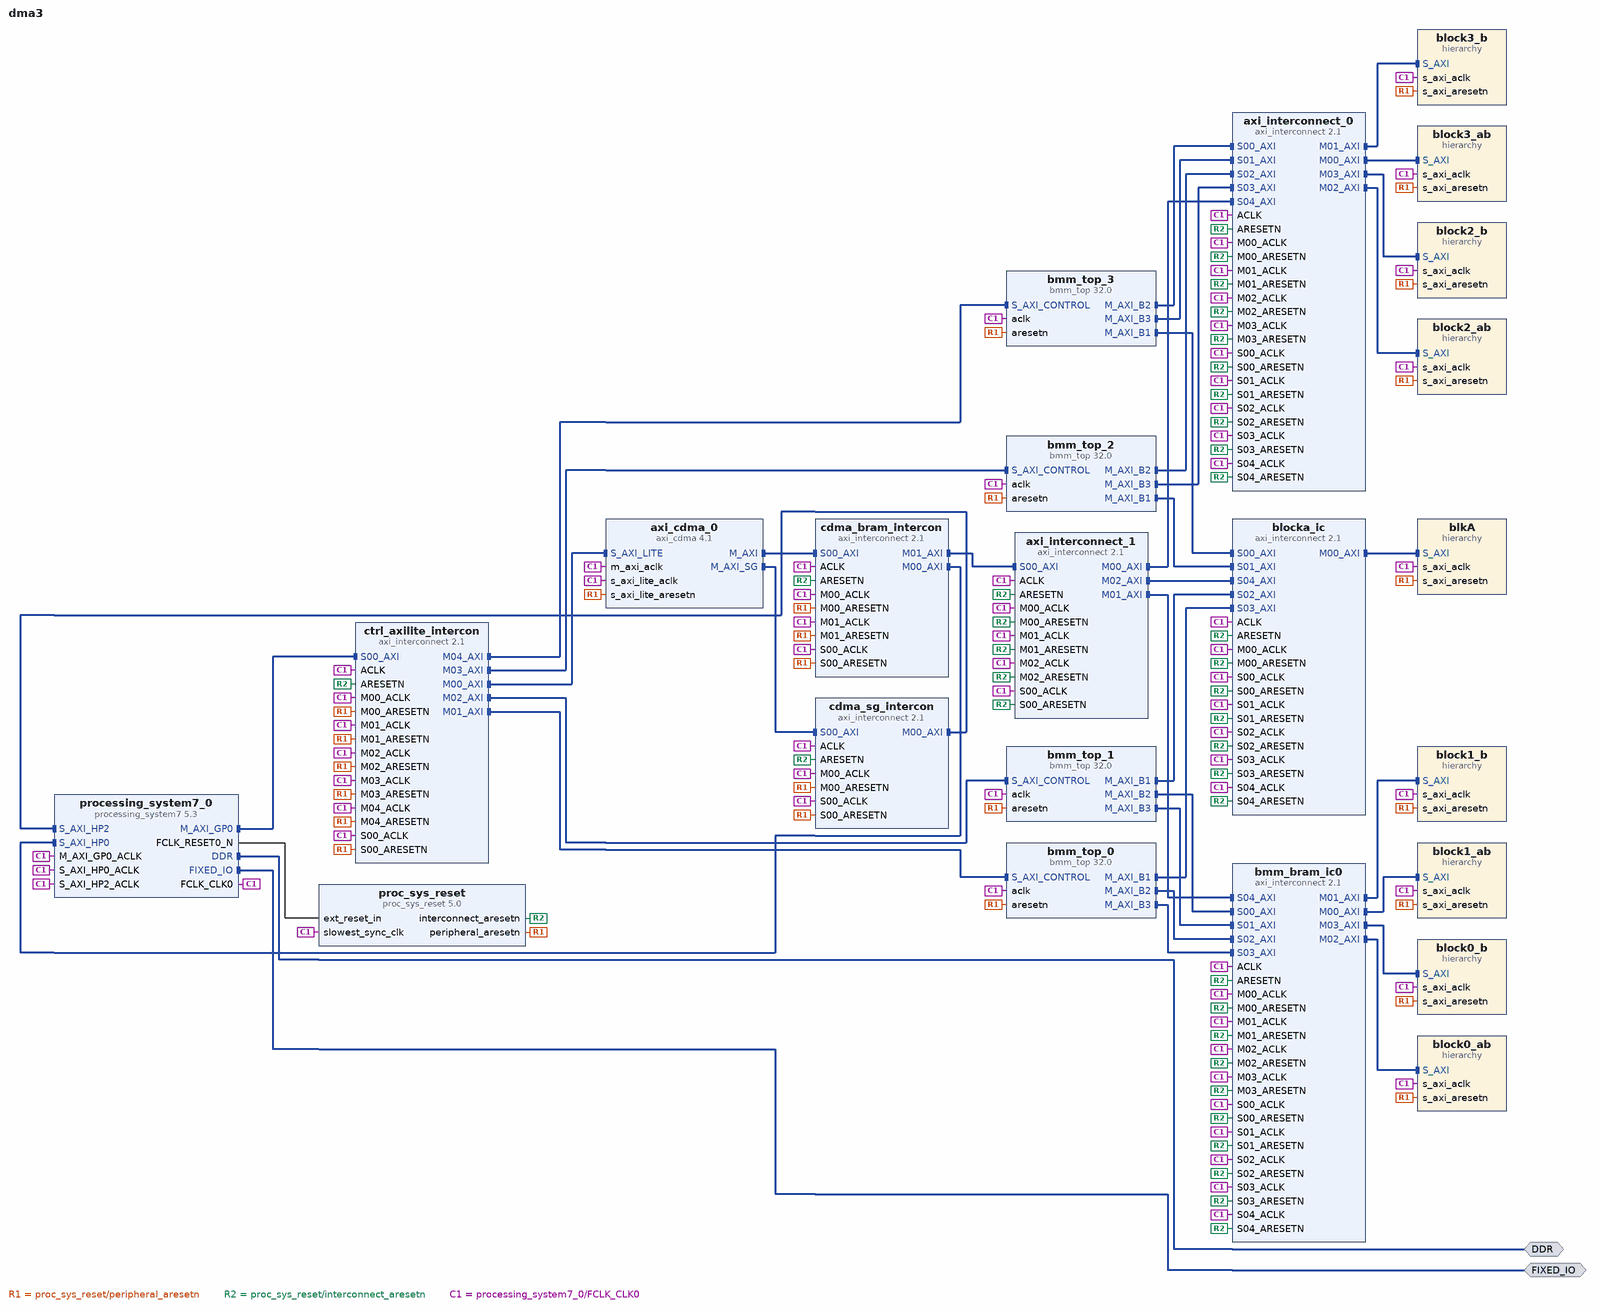
[diagram p0: block diagram of the top level]
# Vivado block design dma3, Vivado 2013.3
create_bd_design dma3

create_bd_intf_port -mode Master -vlnv xilinx.com:interface:ddrx_rtl:1.0 DDR
create_bd_intf_port -mode Master -vlnv xilinx.com:display_processing_system7:fixedio_rtl:1.0 FIXED_IO

create_bd_cell -type ip -vlnv xilinx.com:ip:processing_system7:5.3 processing_system7_0
set_property -dict [list \
  CONFIG.PCW_USE_S_AXI_HP0 1 \
  CONFIG.PCW_USE_S_AXI_HP2 1 \
  CONFIG.PCW_S_AXI_HP0_DATA_WIDTH 32 \
  CONFIG.PCW_S_AXI_HP2_DATA_WIDTH 32 \
  CONFIG.preset {ZC706*} \
] [get_bd_cells processing_system7_0]
create_bd_cell -type ip -vlnv xilinx.com:ip:axi_interconnect:2.1 ctrl_axilite_intercon
set_property -dict {CONFIG.NUM_MI 5} [get_bd_cells ctrl_axilite_intercon]
create_bd_cell -type ip -vlnv xilinx.com:ip:proc_sys_reset:5.0 proc_sys_reset
create_bd_cell -type ip -vlnv xilinx.com:ip:axi_interconnect:2.1 cdma_bram_intercon
set_property -dict {CONFIG.NUM_MI 2} [get_bd_cells cdma_bram_intercon]
create_bd_cell -type ip -vlnv xilinx.com:ip:axi_cdma:4.1 axi_cdma_0
set_property -dict {CONFIG.C_M_AXI_DATA_WIDTH 256 CONFIG.C_M_AXI_MAX_BURST_LEN 16 CONFIG.C_INCLUDE_SG 1} [get_bd_cells axi_cdma_0]
create_bd_cell -type ip -vlnv xilinx.com:ip:axi_interconnect:2.1 cdma_sg_intercon
set_property -dict {CONFIG.NUM_MI 1} [get_bd_cells cdma_sg_intercon]
create_bd_cell -type hier blkA
create_bd_cell -type hier block0_ab
create_bd_cell -type hier block0_b
create_bd_cell -type hier block1_ab
create_bd_cell -type hier block1_b
create_bd_cell -type hier block2_b
create_bd_cell -type hier block2_ab
create_bd_cell -type hier block3_b
create_bd_cell -type hier block3_ab
create_bd_cell -type ip -vlnv xilinx.com:ip:axi_interconnect:2.1 blocka_ic
set_property -dict {CONFIG.NUM_SI 5 CONFIG.NUM_MI 1} [get_bd_cells blocka_ic]
create_bd_cell -type ip -vlnv xilinx.com:ip:axi_interconnect:2.1 bmm_bram_ic0
set_property -dict {CONFIG.NUM_SI 5 CONFIG.NUM_MI 4} [get_bd_cells bmm_bram_ic0]
create_bd_cell -type ip -vlnv xilinx.com:ip:axi_interconnect:2.1 axi_interconnect_0
set_property -dict {CONFIG.NUM_SI 5 CONFIG.NUM_MI 4} [get_bd_cells axi_interconnect_0]
create_bd_cell -type ip -vlnv xilinx.com:ip:axi_interconnect:2.1 axi_interconnect_1
set_property -dict {CONFIG.NUM_SI 1 CONFIG.NUM_MI 3} [get_bd_cells axi_interconnect_1]
create_bd_cell -type ip -vlnv xilinx.com:hls:bmm_top:32.0 bmm_top_0
set_property -dict [list \
  CONFIG.C_M_AXI_B1_DATA_WIDTH 256 \
  CONFIG.C_M_AXI_B1_TARGET_ADDR 0xC0000000 \
  CONFIG.C_M_AXI_B2_DATA_WIDTH 256 \
  CONFIG.C_M_AXI_B2_TARGET_ADDR 0xC1000000 \
  CONFIG.C_M_AXI_B3_DATA_WIDTH 256 \
  CONFIG.C_M_AXI_B3_TARGET_ADDR 0xC2000000 \
] [get_bd_cells bmm_top_0]
create_bd_cell -type ip -vlnv xilinx.com:hls:bmm_top:32.0 bmm_top_1
set_property -dict [list \
  CONFIG.C_M_AXI_B1_DATA_WIDTH 256 \
  CONFIG.C_M_AXI_B1_TARGET_ADDR 0xC0000000 \
  CONFIG.C_M_AXI_B2_DATA_WIDTH 256 \
  CONFIG.C_M_AXI_B2_TARGET_ADDR 0xC3000000 \
  CONFIG.C_M_AXI_B3_DATA_WIDTH 256 \
  CONFIG.C_M_AXI_B3_TARGET_ADDR 0xC4000000 \
] [get_bd_cells bmm_top_1]
create_bd_cell -type ip -vlnv xilinx.com:hls:bmm_top:32.0 bmm_top_2
set_property -dict [list \
  CONFIG.C_M_AXI_B1_DATA_WIDTH 256 \
  CONFIG.C_M_AXI_B1_TARGET_ADDR 0xC0000000 \
  CONFIG.C_M_AXI_B2_DATA_WIDTH 256 \
  CONFIG.C_M_AXI_B2_TARGET_ADDR 0xC5000000 \
  CONFIG.C_M_AXI_B3_DATA_WIDTH 256 \
  CONFIG.C_M_AXI_B3_TARGET_ADDR 0xC6000000 \
] [get_bd_cells bmm_top_2]
create_bd_cell -type ip -vlnv xilinx.com:hls:bmm_top:32.0 bmm_top_3
set_property -dict [list \
  CONFIG.C_M_AXI_B1_DATA_WIDTH 256 \
  CONFIG.C_M_AXI_B1_TARGET_ADDR 0xC0000000 \
  CONFIG.C_M_AXI_B2_DATA_WIDTH 256 \
  CONFIG.C_M_AXI_B2_TARGET_ADDR 0xC7000000 \
  CONFIG.C_M_AXI_B3_DATA_WIDTH 256 \
  CONFIG.C_M_AXI_B3_TARGET_ADDR 0xC8000000 \
] [get_bd_cells bmm_top_3]

# ---- hierarchy /blkA ----
current_bd_instance /blkA
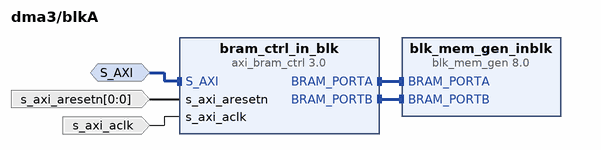
[diagram p1: block diagram inside /blkA]
create_bd_intf_pin -mode Slave -vlnv xilinx.com:interface:aximm_rtl:1.0 S_AXI
create_bd_pin -dir I -from 0 -to 0 -type rst s_axi_aresetn
create_bd_pin -dir I -type clk s_axi_aclk

create_bd_cell -type ip -vlnv xilinx.com:ip:axi_bram_ctrl:3.0 bram_ctrl_in_blk
set_property -dict {CONFIG.DATA_WIDTH 256 CONFIG.PROTOCOL AXI4 CONFIG.SINGLE_PORT_BRAM 0} [get_bd_cells bram_ctrl_in_blk]
create_bd_cell -type ip -vlnv xilinx.com:ip:blk_mem_gen:8.0 blk_mem_gen_inblk
set_property -dict [list \
  CONFIG.Memory_Type True_Dual_Port_RAM \
  CONFIG.Enable_32bit_Address true \
  CONFIG.Write_Width_A 32 \
  CONFIG.Write_Depth_A 8192 \
  CONFIG.Operating_Mode_A WRITE_FIRST \
  CONFIG.use_bram_block BRAM_Controller \
] [get_bd_cells blk_mem_gen_inblk]

# ---- hierarchy /block0_ab ----
current_bd_instance /block0_ab
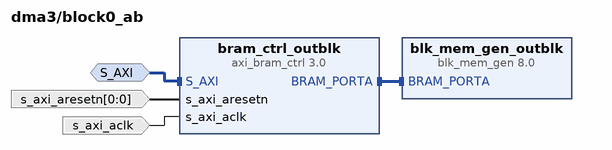
[diagram p2: block diagram inside /block0_ab]
create_bd_intf_pin -mode Slave -vlnv xilinx.com:interface:aximm_rtl:1.0 S_AXI
create_bd_pin -dir I -from 0 -to 0 -type rst s_axi_aresetn
create_bd_pin -dir I -type clk s_axi_aclk

create_bd_cell -type ip -vlnv xilinx.com:ip:axi_bram_ctrl:3.0 bram_ctrl_outblk
set_property -dict {CONFIG.DATA_WIDTH 256 CONFIG.PROTOCOL AXI4 CONFIG.SINGLE_PORT_BRAM 1} [get_bd_cells bram_ctrl_outblk]
create_bd_cell -type ip -vlnv xilinx.com:ip:blk_mem_gen:8.0 blk_mem_gen_outblk
set_property -dict [list \
  CONFIG.Enable_32bit_Address true \
  CONFIG.Write_Width_A 32 \
  CONFIG.Write_Depth_A 8192 \
  CONFIG.Read_Width_A 32 \
  CONFIG.use_bram_block BRAM_Controller \
] [get_bd_cells blk_mem_gen_outblk]

# ---- hierarchy /block0_b ----
current_bd_instance /block0_b
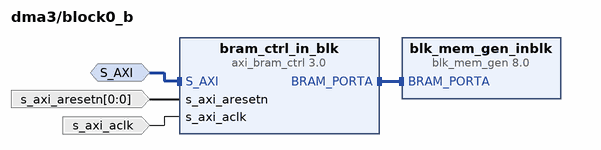
[diagram p3: block diagram inside /block0_b]
create_bd_intf_pin -mode Slave -vlnv xilinx.com:interface:aximm_rtl:1.0 S_AXI
create_bd_pin -dir I -from 0 -to 0 -type rst s_axi_aresetn
create_bd_pin -dir I -type clk s_axi_aclk

create_bd_cell -type ip -vlnv xilinx.com:ip:axi_bram_ctrl:3.0 bram_ctrl_in_blk
set_property -dict {CONFIG.DATA_WIDTH 256 CONFIG.PROTOCOL AXI4 CONFIG.SINGLE_PORT_BRAM 1} [get_bd_cells bram_ctrl_in_blk]
create_bd_cell -type ip -vlnv xilinx.com:ip:blk_mem_gen:8.0 blk_mem_gen_inblk
set_property -dict [list \
  CONFIG.Memory_Type Single_Port_RAM \
  CONFIG.Enable_32bit_Address true \
  CONFIG.Write_Width_A 32 \
  CONFIG.Write_Depth_A 8192 \
  CONFIG.Operating_Mode_A WRITE_FIRST \
  CONFIG.use_bram_block BRAM_Controller \
] [get_bd_cells blk_mem_gen_inblk]

# ---- hierarchy /block1_ab ----
current_bd_instance /block1_ab
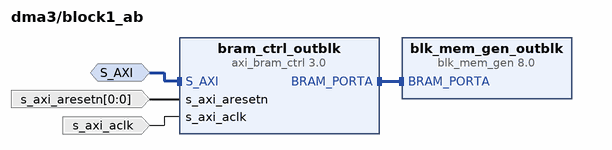
[diagram p4: block diagram inside /block1_ab]
create_bd_intf_pin -mode Slave -vlnv xilinx.com:interface:aximm_rtl:1.0 S_AXI
create_bd_pin -dir I -from 0 -to 0 -type rst s_axi_aresetn
create_bd_pin -dir I -type clk s_axi_aclk

create_bd_cell -type ip -vlnv xilinx.com:ip:axi_bram_ctrl:3.0 bram_ctrl_outblk
set_property -dict {CONFIG.DATA_WIDTH 256 CONFIG.PROTOCOL AXI4 CONFIG.SINGLE_PORT_BRAM 1} [get_bd_cells bram_ctrl_outblk]
create_bd_cell -type ip -vlnv xilinx.com:ip:blk_mem_gen:8.0 blk_mem_gen_outblk
set_property -dict [list \
  CONFIG.Enable_32bit_Address true \
  CONFIG.Write_Width_A 32 \
  CONFIG.Write_Depth_A 8192 \
  CONFIG.use_bram_block BRAM_Controller \
] [get_bd_cells blk_mem_gen_outblk]

# ---- hierarchy /block1_b ----
current_bd_instance /block1_b
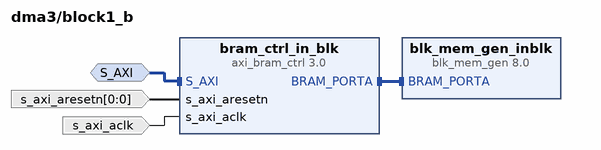
[diagram p5: block diagram inside /block1_b]
create_bd_intf_pin -mode Slave -vlnv xilinx.com:interface:aximm_rtl:1.0 S_AXI
create_bd_pin -dir I -from 0 -to 0 -type rst s_axi_aresetn
create_bd_pin -dir I -type clk s_axi_aclk

create_bd_cell -type ip -vlnv xilinx.com:ip:axi_bram_ctrl:3.0 bram_ctrl_in_blk
set_property -dict {CONFIG.DATA_WIDTH 256 CONFIG.PROTOCOL AXI4 CONFIG.SINGLE_PORT_BRAM 1} [get_bd_cells bram_ctrl_in_blk]
create_bd_cell -type ip -vlnv xilinx.com:ip:blk_mem_gen:8.0 blk_mem_gen_inblk
set_property -dict [list \
  CONFIG.Memory_Type Single_Port_RAM \
  CONFIG.Enable_32bit_Address true \
  CONFIG.Write_Width_A 32 \
  CONFIG.Write_Depth_A 8192 \
  CONFIG.Operating_Mode_A WRITE_FIRST \
  CONFIG.use_bram_block BRAM_Controller \
] [get_bd_cells blk_mem_gen_inblk]

# ---- hierarchy /block2_b ----
current_bd_instance /block2_b
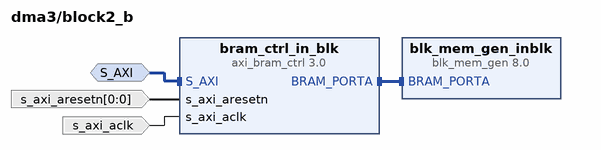
[diagram p6: block diagram inside /block2_b]
create_bd_intf_pin -mode Slave -vlnv xilinx.com:interface:aximm_rtl:1.0 S_AXI
create_bd_pin -dir I -from 0 -to 0 -type rst s_axi_aresetn
create_bd_pin -dir I -type clk s_axi_aclk

create_bd_cell -type ip -vlnv xilinx.com:ip:axi_bram_ctrl:3.0 bram_ctrl_in_blk
set_property -dict {CONFIG.DATA_WIDTH 256 CONFIG.PROTOCOL AXI4 CONFIG.SINGLE_PORT_BRAM 1} [get_bd_cells bram_ctrl_in_blk]
create_bd_cell -type ip -vlnv xilinx.com:ip:blk_mem_gen:8.0 blk_mem_gen_inblk
set_property -dict [list \
  CONFIG.Memory_Type Single_Port_RAM \
  CONFIG.Enable_32bit_Address true \
  CONFIG.Write_Width_A 32 \
  CONFIG.Write_Depth_A 8192 \
  CONFIG.Operating_Mode_A WRITE_FIRST \
  CONFIG.use_bram_block BRAM_Controller \
] [get_bd_cells blk_mem_gen_inblk]

# ---- hierarchy /block2_ab ----
current_bd_instance /block2_ab
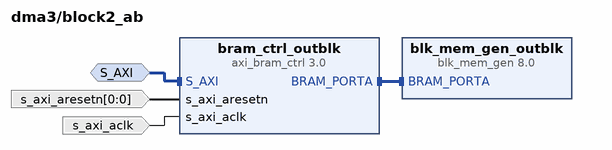
[diagram p7: block diagram inside /block2_ab]
create_bd_intf_pin -mode Slave -vlnv xilinx.com:interface:aximm_rtl:1.0 S_AXI
create_bd_pin -dir I -from 0 -to 0 -type rst s_axi_aresetn
create_bd_pin -dir I -type clk s_axi_aclk

create_bd_cell -type ip -vlnv xilinx.com:ip:axi_bram_ctrl:3.0 bram_ctrl_outblk
set_property -dict {CONFIG.DATA_WIDTH 256 CONFIG.PROTOCOL AXI4 CONFIG.SINGLE_PORT_BRAM 1} [get_bd_cells bram_ctrl_outblk]
create_bd_cell -type ip -vlnv xilinx.com:ip:blk_mem_gen:8.0 blk_mem_gen_outblk
set_property -dict [list \
  CONFIG.Enable_32bit_Address true \
  CONFIG.Write_Width_A 32 \
  CONFIG.Write_Depth_A 8192 \
  CONFIG.use_bram_block BRAM_Controller \
] [get_bd_cells blk_mem_gen_outblk]

# ---- hierarchy /block3_b ----
current_bd_instance /block3_b
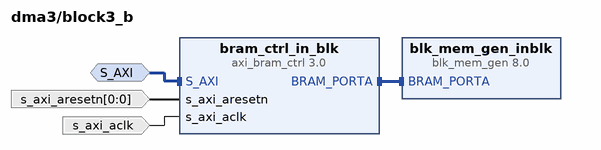
[diagram p8: block diagram inside /block3_b]
create_bd_intf_pin -mode Slave -vlnv xilinx.com:interface:aximm_rtl:1.0 S_AXI
create_bd_pin -dir I -from 0 -to 0 -type rst s_axi_aresetn
create_bd_pin -dir I -type clk s_axi_aclk

create_bd_cell -type ip -vlnv xilinx.com:ip:axi_bram_ctrl:3.0 bram_ctrl_in_blk
set_property -dict {CONFIG.DATA_WIDTH 256 CONFIG.PROTOCOL AXI4 CONFIG.SINGLE_PORT_BRAM 1} [get_bd_cells bram_ctrl_in_blk]
create_bd_cell -type ip -vlnv xilinx.com:ip:blk_mem_gen:8.0 blk_mem_gen_inblk
set_property -dict [list \
  CONFIG.Memory_Type Single_Port_RAM \
  CONFIG.Enable_32bit_Address true \
  CONFIG.Write_Width_A 32 \
  CONFIG.Write_Depth_A 8192 \
  CONFIG.Operating_Mode_A WRITE_FIRST \
  CONFIG.use_bram_block BRAM_Controller \
] [get_bd_cells blk_mem_gen_inblk]

# ---- hierarchy /block3_ab ----
current_bd_instance /block3_ab
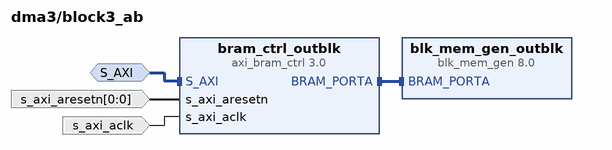
[diagram p9: block diagram inside /block3_ab]
create_bd_intf_pin -mode Slave -vlnv xilinx.com:interface:aximm_rtl:1.0 S_AXI
create_bd_pin -dir I -from 0 -to 0 -type rst s_axi_aresetn
create_bd_pin -dir I -type clk s_axi_aclk

create_bd_cell -type ip -vlnv xilinx.com:ip:axi_bram_ctrl:3.0 bram_ctrl_outblk
set_property -dict {CONFIG.DATA_WIDTH 256 CONFIG.PROTOCOL AXI4 CONFIG.SINGLE_PORT_BRAM 1} [get_bd_cells bram_ctrl_outblk]
create_bd_cell -type ip -vlnv xilinx.com:ip:blk_mem_gen:8.0 blk_mem_gen_outblk
set_property -dict [list \
  CONFIG.Enable_32bit_Address true \
  CONFIG.Write_Width_A 32 \
  CONFIG.Write_Depth_A 8192 \
  CONFIG.Read_Width_A 32 \
  CONFIG.use_bram_block BRAM_Controller \
] [get_bd_cells blk_mem_gen_outblk]

# ---- connections ----

current_bd_instance /blkA
connect_bd_intf_net [get_bd_intf_pins bram_ctrl_in_blk/BRAM_PORTA] [get_bd_intf_pins blk_mem_gen_inblk/BRAM_PORTA]
connect_bd_intf_net [get_bd_intf_pins bram_ctrl_in_blk/BRAM_PORTB] [get_bd_intf_pins blk_mem_gen_inblk/BRAM_PORTB]
connect_bd_intf_net [get_bd_intf_pins S_AXI] [get_bd_intf_pins bram_ctrl_in_blk/S_AXI]
connect_bd_net -net proc_sys_reset_peripheral_aresetn [get_bd_pins s_axi_aresetn] [get_bd_pins bram_ctrl_in_blk/s_axi_aresetn]
connect_bd_net -net processing_system7_0_fclk_clk0 [get_bd_pins s_axi_aclk] [get_bd_pins bram_ctrl_in_blk/s_axi_aclk]

current_bd_instance /block0_ab
connect_bd_intf_net [get_bd_intf_pins bram_ctrl_outblk/BRAM_PORTA] [get_bd_intf_pins blk_mem_gen_outblk/BRAM_PORTA]
connect_bd_intf_net [get_bd_intf_pins S_AXI] [get_bd_intf_pins bram_ctrl_outblk/S_AXI]
connect_bd_net -net proc_sys_reset_peripheral_aresetn [get_bd_pins s_axi_aresetn] [get_bd_pins bram_ctrl_outblk/s_axi_aresetn]
connect_bd_net -net processing_system7_0_fclk_clk0 [get_bd_pins s_axi_aclk] [get_bd_pins bram_ctrl_outblk/s_axi_aclk]

current_bd_instance /block0_b
connect_bd_intf_net [get_bd_intf_pins bram_ctrl_in_blk/BRAM_PORTA] [get_bd_intf_pins blk_mem_gen_inblk/BRAM_PORTA]
connect_bd_intf_net [get_bd_intf_pins S_AXI] [get_bd_intf_pins bram_ctrl_in_blk/S_AXI]
connect_bd_net -net proc_sys_reset_peripheral_aresetn [get_bd_pins s_axi_aresetn] [get_bd_pins bram_ctrl_in_blk/s_axi_aresetn]
connect_bd_net -net processing_system7_0_fclk_clk0 [get_bd_pins s_axi_aclk] [get_bd_pins bram_ctrl_in_blk/s_axi_aclk]

current_bd_instance /block1_ab
connect_bd_intf_net [get_bd_intf_pins bram_ctrl_outblk/BRAM_PORTA] [get_bd_intf_pins blk_mem_gen_outblk/BRAM_PORTA]
connect_bd_intf_net [get_bd_intf_pins S_AXI] [get_bd_intf_pins bram_ctrl_outblk/S_AXI]
connect_bd_net -net proc_sys_reset_peripheral_aresetn [get_bd_pins s_axi_aresetn] [get_bd_pins bram_ctrl_outblk/s_axi_aresetn]
connect_bd_net -net processing_system7_0_fclk_clk0 [get_bd_pins s_axi_aclk] [get_bd_pins bram_ctrl_outblk/s_axi_aclk]

current_bd_instance /block1_b
connect_bd_intf_net [get_bd_intf_pins bram_ctrl_in_blk/BRAM_PORTA] [get_bd_intf_pins blk_mem_gen_inblk/BRAM_PORTA]
connect_bd_intf_net [get_bd_intf_pins S_AXI] [get_bd_intf_pins bram_ctrl_in_blk/S_AXI]
connect_bd_net -net proc_sys_reset_peripheral_aresetn [get_bd_pins s_axi_aresetn] [get_bd_pins bram_ctrl_in_blk/s_axi_aresetn]
connect_bd_net -net processing_system7_0_fclk_clk0 [get_bd_pins s_axi_aclk] [get_bd_pins bram_ctrl_in_blk/s_axi_aclk]

current_bd_instance /block2_b
connect_bd_intf_net [get_bd_intf_pins bram_ctrl_in_blk/BRAM_PORTA] [get_bd_intf_pins blk_mem_gen_inblk/BRAM_PORTA]
connect_bd_intf_net [get_bd_intf_pins S_AXI] [get_bd_intf_pins bram_ctrl_in_blk/S_AXI]
connect_bd_net -net proc_sys_reset_peripheral_aresetn [get_bd_pins s_axi_aresetn] [get_bd_pins bram_ctrl_in_blk/s_axi_aresetn]
connect_bd_net -net processing_system7_0_fclk_clk0 [get_bd_pins s_axi_aclk] [get_bd_pins bram_ctrl_in_blk/s_axi_aclk]

current_bd_instance /block2_ab
connect_bd_intf_net [get_bd_intf_pins bram_ctrl_outblk/BRAM_PORTA] [get_bd_intf_pins blk_mem_gen_outblk/BRAM_PORTA]
connect_bd_intf_net [get_bd_intf_pins S_AXI] [get_bd_intf_pins bram_ctrl_outblk/S_AXI]
connect_bd_net -net proc_sys_reset_peripheral_aresetn [get_bd_pins s_axi_aresetn] [get_bd_pins bram_ctrl_outblk/s_axi_aresetn]
connect_bd_net -net processing_system7_0_fclk_clk0 [get_bd_pins s_axi_aclk] [get_bd_pins bram_ctrl_outblk/s_axi_aclk]

current_bd_instance /block3_b
connect_bd_intf_net [get_bd_intf_pins bram_ctrl_in_blk/BRAM_PORTA] [get_bd_intf_pins blk_mem_gen_inblk/BRAM_PORTA]
connect_bd_intf_net [get_bd_intf_pins S_AXI] [get_bd_intf_pins bram_ctrl_in_blk/S_AXI]
connect_bd_net -net proc_sys_reset_peripheral_aresetn [get_bd_pins s_axi_aresetn] [get_bd_pins bram_ctrl_in_blk/s_axi_aresetn]
connect_bd_net -net processing_system7_0_fclk_clk0 [get_bd_pins s_axi_aclk] [get_bd_pins bram_ctrl_in_blk/s_axi_aclk]

current_bd_instance /block3_ab
connect_bd_intf_net [get_bd_intf_pins bram_ctrl_outblk/BRAM_PORTA] [get_bd_intf_pins blk_mem_gen_outblk/BRAM_PORTA]
connect_bd_intf_net [get_bd_intf_pins S_AXI] [get_bd_intf_pins bram_ctrl_outblk/S_AXI]
connect_bd_net -net proc_sys_reset_peripheral_aresetn [get_bd_pins s_axi_aresetn] [get_bd_pins bram_ctrl_outblk/s_axi_aresetn]
connect_bd_net -net processing_system7_0_fclk_clk0 [get_bd_pins s_axi_aclk] [get_bd_pins bram_ctrl_outblk/s_axi_aclk]

current_bd_instance /
connect_bd_intf_net [get_bd_intf_pins processing_system7_0/M_AXI_GP0] [get_bd_intf_pins ctrl_axilite_intercon/S00_AXI]
connect_bd_intf_net [get_bd_intf_pins ctrl_axilite_intercon/M00_AXI] [get_bd_intf_pins axi_cdma_0/S_AXI_LITE]
connect_bd_intf_net [get_bd_intf_pins axi_cdma_0/M_AXI_SG] [get_bd_intf_pins cdma_sg_intercon/S00_AXI]
connect_bd_intf_net [get_bd_intf_pins cdma_sg_intercon/M00_AXI] [get_bd_intf_pins processing_system7_0/S_AXI_HP2]
connect_bd_intf_net [get_bd_intf_pins ctrl_axilite_intercon/M01_AXI] [get_bd_intf_pins bmm_top_0/S_AXI_CONTROL]
connect_bd_intf_net [get_bd_intf_pins bmm_top_1/S_AXI_CONTROL] [get_bd_intf_pins ctrl_axilite_intercon/M02_AXI]
connect_bd_intf_net [get_bd_intf_pins bmm_top_2/S_AXI_CONTROL] [get_bd_intf_pins ctrl_axilite_intercon/M03_AXI]
connect_bd_intf_net [get_bd_intf_pins bmm_top_3/S_AXI_CONTROL] [get_bd_intf_pins ctrl_axilite_intercon/M04_AXI]
connect_bd_intf_net [get_bd_intf_pins bmm_top_3/M_AXI_B1] [get_bd_intf_pins blocka_ic/S00_AXI]
connect_bd_intf_net [get_bd_intf_pins bmm_top_2/M_AXI_B1] [get_bd_intf_pins blocka_ic/S01_AXI]
connect_bd_intf_net [get_bd_intf_pins bmm_top_1/M_AXI_B1] [get_bd_intf_pins blocka_ic/S02_AXI]
connect_bd_intf_net [get_bd_intf_pins bmm_top_0/M_AXI_B1] [get_bd_intf_pins blocka_ic/S03_AXI]
connect_bd_intf_net [get_bd_intf_pins blocka_ic/M00_AXI] [get_bd_intf_pins blkA/S_AXI]
connect_bd_intf_net [get_bd_intf_pins bmm_top_1/M_AXI_B2] [get_bd_intf_pins bmm_bram_ic0/S00_AXI]
connect_bd_intf_net [get_bd_intf_pins bmm_top_1/M_AXI_B3] [get_bd_intf_pins bmm_bram_ic0/S01_AXI]
connect_bd_intf_net [get_bd_intf_pins bmm_top_0/M_AXI_B2] [get_bd_intf_pins bmm_bram_ic0/S02_AXI]
connect_bd_intf_net [get_bd_intf_pins bmm_top_0/M_AXI_B3] [get_bd_intf_pins bmm_bram_ic0/S03_AXI]
connect_bd_intf_net [get_bd_intf_pins bmm_bram_ic0/M03_AXI] [get_bd_intf_pins block0_b/S_AXI]
connect_bd_intf_net [get_bd_intf_pins bmm_bram_ic0/M02_AXI] [get_bd_intf_pins block0_ab/S_AXI]
connect_bd_intf_net [get_bd_intf_pins bmm_bram_ic0/M01_AXI] [get_bd_intf_pins block1_b/S_AXI]
connect_bd_intf_net [get_bd_intf_pins bmm_bram_ic0/M00_AXI] [get_bd_intf_pins block1_ab/S_AXI]
connect_bd_intf_net [get_bd_intf_pins bmm_top_3/M_AXI_B2] [get_bd_intf_pins axi_interconnect_0/S00_AXI]
connect_bd_intf_net [get_bd_intf_pins bmm_top_3/M_AXI_B3] [get_bd_intf_pins axi_interconnect_0/S01_AXI]
connect_bd_intf_net [get_bd_intf_pins bmm_top_2/M_AXI_B2] [get_bd_intf_pins axi_interconnect_0/S02_AXI]
connect_bd_intf_net [get_bd_intf_pins bmm_top_2/M_AXI_B3] [get_bd_intf_pins axi_interconnect_0/S03_AXI]
connect_bd_intf_net [get_bd_intf_pins axi_interconnect_0/M03_AXI] [get_bd_intf_pins block2_b/S_AXI]
connect_bd_intf_net [get_bd_intf_pins axi_interconnect_0/M02_AXI] [get_bd_intf_pins block2_ab/S_AXI]
connect_bd_intf_net [get_bd_intf_pins axi_interconnect_0/M01_AXI] [get_bd_intf_pins block3_b/S_AXI]
connect_bd_intf_net [get_bd_intf_pins axi_interconnect_0/M00_AXI] [get_bd_intf_pins block3_ab/S_AXI]
connect_bd_intf_net [get_bd_intf_pins axi_cdma_0/M_AXI] [get_bd_intf_pins cdma_bram_intercon/S00_AXI]
connect_bd_intf_net [get_bd_intf_pins axi_interconnect_1/M00_AXI] [get_bd_intf_pins axi_interconnect_0/S04_AXI]
connect_bd_intf_net [get_bd_intf_pins axi_interconnect_1/M01_AXI] [get_bd_intf_pins bmm_bram_ic0/S04_AXI]
connect_bd_intf_net [get_bd_intf_pins axi_interconnect_1/M02_AXI] [get_bd_intf_pins blocka_ic/S04_AXI]
connect_bd_intf_net [get_bd_intf_pins cdma_bram_intercon/M01_AXI] [get_bd_intf_pins axi_interconnect_1/S00_AXI]
connect_bd_intf_net [get_bd_intf_pins cdma_bram_intercon/M00_AXI] [get_bd_intf_pins processing_system7_0/S_AXI_HP0]
connect_bd_intf_net [get_bd_intf_ports DDR] [get_bd_intf_pins processing_system7_0/DDR]
connect_bd_intf_net [get_bd_intf_ports FIXED_IO] [get_bd_intf_pins processing_system7_0/FIXED_IO]
connect_bd_net [get_bd_pins processing_system7_0/FCLK_RESET0_N] [get_bd_pins proc_sys_reset/ext_reset_in]
connect_bd_net [get_bd_pins proc_sys_reset/peripheral_aresetn] \
  [get_bd_pins ctrl_axilite_intercon/S00_ARESETN] [get_bd_pins ctrl_axilite_intercon/M00_ARESETN] \
  [get_bd_pins cdma_bram_intercon/S00_ARESETN] [get_bd_pins cdma_bram_intercon/M00_ARESETN] \
  [get_bd_pins axi_cdma_0/s_axi_lite_aresetn] [get_bd_pins cdma_bram_intercon/M01_ARESETN] \
  [get_bd_pins ctrl_axilite_intercon/M01_ARESETN] [get_bd_pins cdma_sg_intercon/S00_ARESETN] \
  [get_bd_pins cdma_sg_intercon/M00_ARESETN] [get_bd_pins ctrl_axilite_intercon/M02_ARESETN] \
  [get_bd_pins ctrl_axilite_intercon/M03_ARESETN] [get_bd_pins ctrl_axilite_intercon/M04_ARESETN] \
  [get_bd_pins block2_ab/s_axi_aresetn] [get_bd_pins block2_b/s_axi_aresetn] [get_bd_pins block3_ab/s_axi_aresetn] \
  [get_bd_pins block3_b/s_axi_aresetn] [get_bd_pins block1_ab/s_axi_aresetn] [get_bd_pins block1_b/s_axi_aresetn] \
  [get_bd_pins block0_ab/s_axi_aresetn] [get_bd_pins block0_b/s_axi_aresetn] [get_bd_pins blkA/s_axi_aresetn] \
  [get_bd_pins bmm_top_0/aresetn] [get_bd_pins bmm_top_1/aresetn] [get_bd_pins bmm_top_2/aresetn] \
  [get_bd_pins bmm_top_3/aresetn]
connect_bd_net [get_bd_pins proc_sys_reset/interconnect_aresetn] \
  [get_bd_pins ctrl_axilite_intercon/ARESETN] [get_bd_pins cdma_bram_intercon/ARESETN] [get_bd_pins cdma_sg_intercon/ARESETN] \
  [get_bd_pins blocka_ic/ARESETN] [get_bd_pins bmm_bram_ic0/ARESETN] [get_bd_pins axi_interconnect_0/ARESETN] \
  [get_bd_pins axi_interconnect_0/S00_ARESETN] [get_bd_pins axi_interconnect_0/M00_ARESETN] \
  [get_bd_pins axi_interconnect_0/M01_ARESETN] [get_bd_pins axi_interconnect_0/S01_ARESETN] \
  [get_bd_pins axi_interconnect_0/S02_ARESETN] [get_bd_pins axi_interconnect_0/S03_ARESETN] \
  [get_bd_pins axi_interconnect_0/M02_ARESETN] [get_bd_pins axi_interconnect_0/M03_ARESETN] \
  [get_bd_pins bmm_bram_ic0/S00_ARESETN] [get_bd_pins bmm_bram_ic0/M00_ARESETN] [get_bd_pins bmm_bram_ic0/M01_ARESETN] \
  [get_bd_pins bmm_bram_ic0/S01_ARESETN] [get_bd_pins bmm_bram_ic0/S02_ARESETN] [get_bd_pins bmm_bram_ic0/S03_ARESETN] \
  [get_bd_pins bmm_bram_ic0/M02_ARESETN] [get_bd_pins bmm_bram_ic0/M03_ARESETN] [get_bd_pins blocka_ic/S00_ARESETN] \
  [get_bd_pins blocka_ic/M00_ARESETN] [get_bd_pins blocka_ic/S01_ARESETN] [get_bd_pins blocka_ic/S02_ARESETN] \
  [get_bd_pins blocka_ic/S03_ARESETN] [get_bd_pins blocka_ic/S04_ARESETN] [get_bd_pins axi_interconnect_0/S04_ARESETN] \
  [get_bd_pins bmm_bram_ic0/S04_ARESETN] [get_bd_pins axi_interconnect_1/ARESETN] \
  [get_bd_pins axi_interconnect_1/S00_ARESETN] [get_bd_pins axi_interconnect_1/M00_ARESETN] \
  [get_bd_pins axi_interconnect_1/M01_ARESETN] [get_bd_pins axi_interconnect_1/M02_ARESETN]
connect_bd_net [get_bd_pins processing_system7_0/FCLK_CLK0] \
  [get_bd_pins processing_system7_0/M_AXI_GP0_ACLK] [get_bd_pins ctrl_axilite_intercon/S00_ACLK] \
  [get_bd_pins proc_sys_reset/slowest_sync_clk] [get_bd_pins ctrl_axilite_intercon/ACLK] \
  [get_bd_pins ctrl_axilite_intercon/M00_ACLK] [get_bd_pins cdma_bram_intercon/S00_ACLK] \
  [get_bd_pins cdma_bram_intercon/ACLK] [get_bd_pins processing_system7_0/S_AXI_HP0_ACLK] \
  [get_bd_pins cdma_bram_intercon/M00_ACLK] [get_bd_pins axi_cdma_0/s_axi_lite_aclk] \
  [get_bd_pins cdma_bram_intercon/M01_ACLK] [get_bd_pins axi_cdma_0/m_axi_aclk] [get_bd_pins ctrl_axilite_intercon/M01_ACLK] \
  [get_bd_pins cdma_sg_intercon/S00_ACLK] [get_bd_pins cdma_sg_intercon/ACLK] \
  [get_bd_pins processing_system7_0/S_AXI_HP2_ACLK] [get_bd_pins cdma_sg_intercon/M00_ACLK] \
  [get_bd_pins ctrl_axilite_intercon/M02_ACLK] [get_bd_pins ctrl_axilite_intercon/M03_ACLK] \
  [get_bd_pins ctrl_axilite_intercon/M04_ACLK] [get_bd_pins block2_ab/s_axi_aclk] [get_bd_pins block2_b/s_axi_aclk] \
  [get_bd_pins block3_ab/s_axi_aclk] [get_bd_pins block3_b/s_axi_aclk] [get_bd_pins axi_interconnect_0/ACLK] \
  [get_bd_pins bmm_bram_ic0/ACLK] [get_bd_pins blocka_ic/ACLK] [get_bd_pins axi_interconnect_0/S00_ACLK] \
  [get_bd_pins axi_interconnect_0/M00_ACLK] [get_bd_pins axi_interconnect_0/M01_ACLK] \
  [get_bd_pins axi_interconnect_0/S01_ACLK] [get_bd_pins axi_interconnect_0/S02_ACLK] \
  [get_bd_pins axi_interconnect_0/S03_ACLK] [get_bd_pins axi_interconnect_0/M02_ACLK] \
  [get_bd_pins axi_interconnect_0/M03_ACLK] [get_bd_pins bmm_bram_ic0/S00_ACLK] [get_bd_pins bmm_bram_ic0/M00_ACLK] \
  [get_bd_pins bmm_bram_ic0/M01_ACLK] [get_bd_pins bmm_bram_ic0/S01_ACLK] [get_bd_pins bmm_bram_ic0/S02_ACLK] \
  [get_bd_pins bmm_bram_ic0/S03_ACLK] [get_bd_pins bmm_bram_ic0/M02_ACLK] [get_bd_pins bmm_bram_ic0/M03_ACLK] \
  [get_bd_pins blocka_ic/S00_ACLK] [get_bd_pins blocka_ic/M00_ACLK] [get_bd_pins blocka_ic/S01_ACLK] \
  [get_bd_pins blocka_ic/S02_ACLK] [get_bd_pins blocka_ic/S03_ACLK] [get_bd_pins blocka_ic/S04_ACLK] \
  [get_bd_pins block1_ab/s_axi_aclk] [get_bd_pins block1_b/s_axi_aclk] [get_bd_pins block0_ab/s_axi_aclk] \
  [get_bd_pins block0_b/s_axi_aclk] [get_bd_pins blkA/s_axi_aclk] [get_bd_pins axi_interconnect_0/S04_ACLK] \
  [get_bd_pins bmm_bram_ic0/S04_ACLK] [get_bd_pins axi_interconnect_1/ACLK] [get_bd_pins axi_interconnect_1/S00_ACLK] \
  [get_bd_pins axi_interconnect_1/M00_ACLK] [get_bd_pins axi_interconnect_1/M01_ACLK] \
  [get_bd_pins axi_interconnect_1/M02_ACLK] [get_bd_pins bmm_top_0/aclk] [get_bd_pins bmm_top_1/aclk] \
  [get_bd_pins bmm_top_2/aclk] [get_bd_pins bmm_top_3/aclk]

# ---- address map ----
assign_bd_address -offset 0x20000000 -range 512M -target_address_space [get_bd_addr_spaces axi_cdma_0/Data] [get_bd_addr_segs processing_system7_0/S_AXI_HP0/HP0_DDR_LOWOCM]
assign_bd_address -offset 0xC0000000 -range 128K -target_address_space [get_bd_addr_spaces axi_cdma_0/Data] [get_bd_addr_segs blkA/bram_ctrl_in_blk/S_AXI/Mem0]
assign_bd_address -offset 0xC1000000 -range 128K -target_address_space [get_bd_addr_spaces axi_cdma_0/Data] [get_bd_addr_segs block0_b/bram_ctrl_in_blk/S_AXI/Mem0]
assign_bd_address -offset 0xC2000000 -range 128K -target_address_space [get_bd_addr_spaces axi_cdma_0/Data] [get_bd_addr_segs block0_ab/bram_ctrl_outblk/S_AXI/Mem0]
assign_bd_address -offset 0xC3000000 -range 128K -target_address_space [get_bd_addr_spaces axi_cdma_0/Data] [get_bd_addr_segs block1_b/bram_ctrl_in_blk/S_AXI/Mem0]
assign_bd_address -offset 0xC4000000 -range 128K -target_address_space [get_bd_addr_spaces axi_cdma_0/Data] [get_bd_addr_segs block1_ab/bram_ctrl_outblk/S_AXI/Mem0]
assign_bd_address -offset 0xC5000000 -range 128K -target_address_space [get_bd_addr_spaces axi_cdma_0/Data] [get_bd_addr_segs block2_b/bram_ctrl_in_blk/S_AXI/Mem0]
assign_bd_address -offset 0xC6000000 -range 128K -target_address_space [get_bd_addr_spaces axi_cdma_0/Data] [get_bd_addr_segs block2_ab/bram_ctrl_outblk/S_AXI/Mem0]
assign_bd_address -offset 0xC7000000 -range 128K -target_address_space [get_bd_addr_spaces axi_cdma_0/Data] [get_bd_addr_segs block3_b/bram_ctrl_in_blk/S_AXI/Mem0]
assign_bd_address -offset 0xC8000000 -range 128K -target_address_space [get_bd_addr_spaces axi_cdma_0/Data] [get_bd_addr_segs block3_ab/bram_ctrl_outblk/S_AXI/Mem0]
assign_bd_address -offset 0x20000000 -range 512M -target_address_space [get_bd_addr_spaces axi_cdma_0/Data_SG] [get_bd_addr_segs processing_system7_0/S_AXI_HP2/HP2_DDR_LOWOCM]
assign_bd_address -offset 0xC0000000 -range 128K -target_address_space [get_bd_addr_spaces bmm_top_0/Data] [get_bd_addr_segs blkA/bram_ctrl_in_blk/S_AXI/Mem0]
assign_bd_address -offset 0xC1000000 -range 128K -target_address_space [get_bd_addr_spaces bmm_top_0/Data] [get_bd_addr_segs block0_b/bram_ctrl_in_blk/S_AXI/Mem0]
assign_bd_address -offset 0xC2000000 -range 128K -target_address_space [get_bd_addr_spaces bmm_top_0/Data] [get_bd_addr_segs block0_ab/bram_ctrl_outblk/S_AXI/Mem0]
assign_bd_address -offset 0xC0000000 -range 128K -target_address_space [get_bd_addr_spaces bmm_top_1/Data] [get_bd_addr_segs blkA/bram_ctrl_in_blk/S_AXI/Mem0]
assign_bd_address -offset 0xC3000000 -range 128K -target_address_space [get_bd_addr_spaces bmm_top_1/Data] [get_bd_addr_segs block1_b/bram_ctrl_in_blk/S_AXI/Mem0]
assign_bd_address -offset 0xC4000000 -range 128K -target_address_space [get_bd_addr_spaces bmm_top_1/Data] [get_bd_addr_segs block1_ab/bram_ctrl_outblk/S_AXI/Mem0]
assign_bd_address -offset 0xC0000000 -range 128K -target_address_space [get_bd_addr_spaces bmm_top_2/Data] [get_bd_addr_segs blkA/bram_ctrl_in_blk/S_AXI/Mem0]
assign_bd_address -offset 0xC5000000 -range 128K -target_address_space [get_bd_addr_spaces bmm_top_2/Data] [get_bd_addr_segs block2_b/bram_ctrl_in_blk/S_AXI/Mem0]
assign_bd_address -offset 0xC6000000 -range 128K -target_address_space [get_bd_addr_spaces bmm_top_2/Data] [get_bd_addr_segs block2_ab/bram_ctrl_outblk/S_AXI/Mem0]
assign_bd_address -offset 0xC0000000 -range 128K -target_address_space [get_bd_addr_spaces bmm_top_3/Data] [get_bd_addr_segs blkA/bram_ctrl_in_blk/S_AXI/Mem0]
assign_bd_address -offset 0xC7000000 -range 128K -target_address_space [get_bd_addr_spaces bmm_top_3/Data] [get_bd_addr_segs block3_b/bram_ctrl_in_blk/S_AXI/Mem0]
assign_bd_address -offset 0xC8000000 -range 128K -target_address_space [get_bd_addr_spaces bmm_top_3/Data] [get_bd_addr_segs block3_ab/bram_ctrl_outblk/S_AXI/Mem0]
assign_bd_address -offset 0x43C00000 -range 64K -target_address_space [get_bd_addr_spaces processing_system7_0/Data] [get_bd_addr_segs bmm_top_0/S_AXI_CONTROL/Reg]
assign_bd_address -offset 0x43C10000 -range 64K -target_address_space [get_bd_addr_spaces processing_system7_0/Data] [get_bd_addr_segs bmm_top_1/S_AXI_CONTROL/Reg]
assign_bd_address -offset 0x43C20000 -range 64K -target_address_space [get_bd_addr_spaces processing_system7_0/Data] [get_bd_addr_segs bmm_top_2/S_AXI_CONTROL/Reg]
assign_bd_address -offset 0x43C30000 -range 64K -target_address_space [get_bd_addr_spaces processing_system7_0/Data] [get_bd_addr_segs bmm_top_3/S_AXI_CONTROL/Reg]
assign_bd_address -offset 0x7E200000 -range 64K -target_address_space [get_bd_addr_spaces processing_system7_0/Data] [get_bd_addr_segs axi_cdma_0/S_AXI_LITE/Reg]

validate_bd_design
save_bd_design
